# Altium schematic sheet Modulator.SchDoc
size A
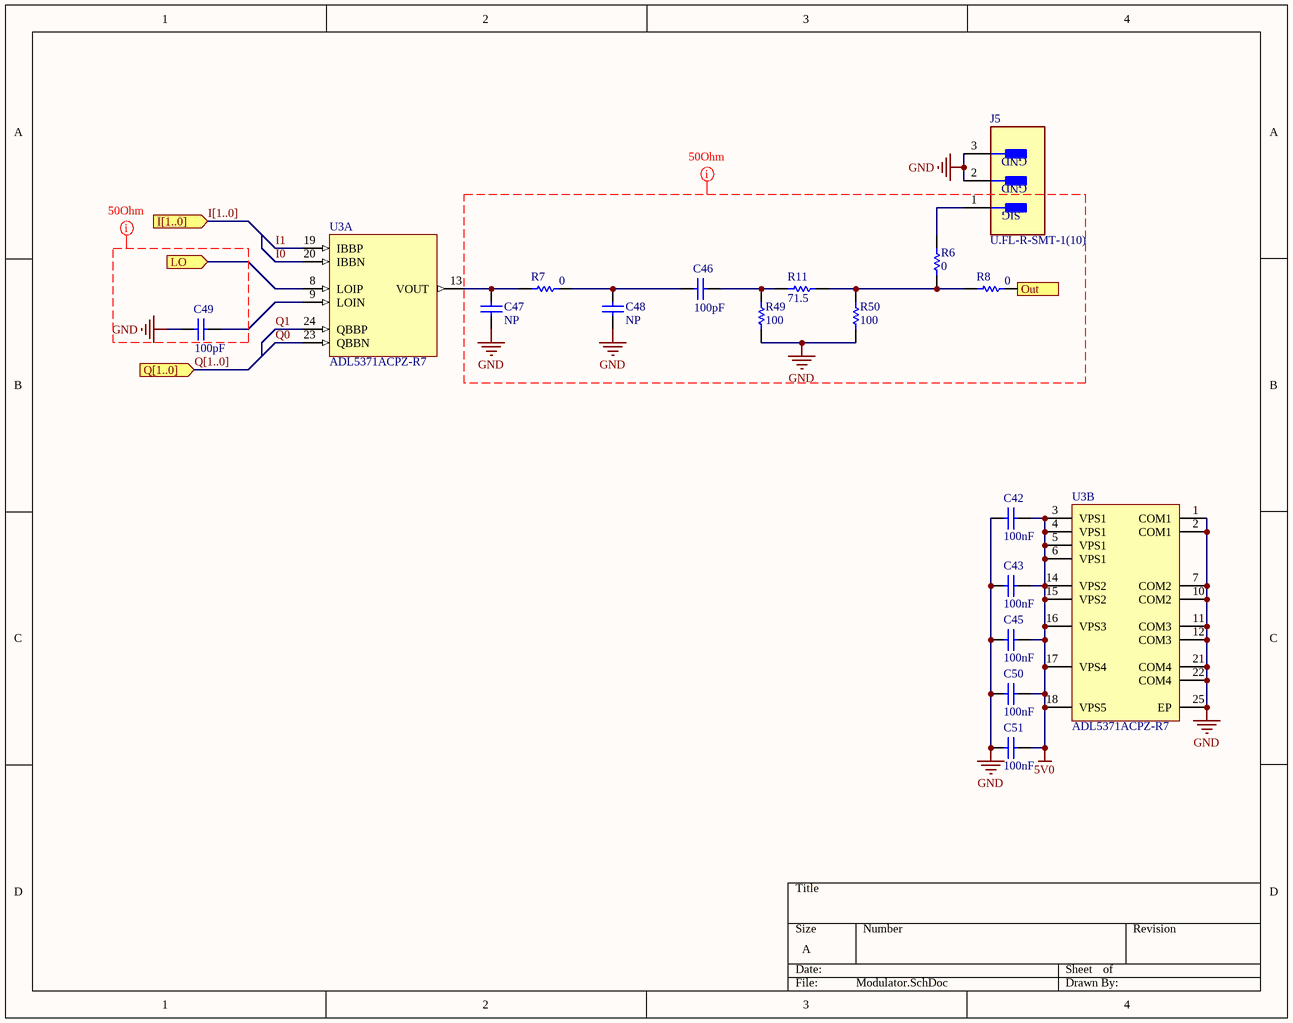
[diagram p0: Modulator.SchDoc]

## Parts
C42  value 100nF  [0402-A]  (hidden comment: Cap)
C43  value 100nF  [0402-A]  (hidden comment: Cap)
C45  value 100nF  [0402-A]  (hidden comment: Cap)
C46  value 100pF  [0402-A]  (hidden comment: Cap)
C47  value NP  [0402-A]  (hidden comment: Cap)
C48  value NP  [0402-A]  (hidden comment: Cap)
C49  value 100pF  [0402-A]  (hidden comment: Cap)
C50  value 100nF  [0402-A]  (hidden comment: Cap)
C51  value 100nF  [0402-A]  (hidden comment: Cap)
J5  U.FL-R-SMT-1(10)  [FP-U_FL-R-SMT-1_10-MFG]
R6  value 0  [0402-A]  (hidden comment: Res1)
R7  value 0  [0402-A]  (hidden comment: Res1)
R8  value 0  [0402-A]  (hidden comment: Res1)
R11  value 71.5  [0402-A]  (hidden comment: Res1)
R49  value 100  [0402-A]  (hidden comment: Res1)
R50  value 100  [0402-A]  (hidden comment: Res1)
U3  ADL5371ACPZ-R7  [ADI-CP-24-2_N]  (parts A,B of 2)

## Ports
I[1..0] (in), LO (in), Out (out), Q[1..0] (in)

## Nets
5V0: C42.2 C43.2 C45.2 C50.2 C51.2 U3.3(VPS1) U3.4(VPS1) U3.5(VPS1) U3.6(VPS1) U3.14(VPS2) U3.15(VPS2) U3.16(VPS3) U3.17(VPS4) U3.18(VPS5)
GND: C42.1 C43.1 C45.1 C47.2 C48.2 C49.2 C50.1 C51.1 J5.2(GND) J5.3(GND) R49.2 R50.2 U3.1(COM1) U3.2(COM1) U3.7(COM2) U3.10(COM2) U3.11(COM3) U3.12(COM3) U3.21(COM4) U3.22(COM4) U3.25(EP)
I0: U3.20(IBBN)
I1: U3.19(IBBP)
LO: U3.8(LOIP) ; port LO
Out: R8.1 ; port Out
Q0: U3.23(QBBN)
Q1: U3.24(QBBP)
NetC46_1: C46.1 R11.1 R49.1
NetC46_2: C46.2 C48.1 R7.1
NetC47_1: C47.1 R7.2 U3.13(VOUT)
NetC49_1: C49.1 U3.9(LOIN)
NetJ5_1: J5.1(SIG) R6.1
NetR6_2: R6.2 R8.2 R11.2 R50.1

## Buses and harness runs
bus I[1..0] = port I[1..0]
bus Q[1..0] = port Q[1..0]

## Layout directives
net class 50Ohm: GND

## Library data of the parts
C42 C43 C45-C51 = Cap: Capacitor; Published: 8-Jun-2000; LatestRevisionDate: 17-Jul-2002; LatestRevisionNote: Re-released for DXP Platform.; PackageReference: RAD-0.3; Publisher: Altium Limited; PackageDescription: Radial Cap, Thru-Hole; 2 Leads; 0.3 in Pin Spacing
J5 = CMP-2000-05152-2: CONN U.FL RCPT STR 50 OHM SMD; Body Plating: Silver; Impedance: 50R; Frequency: 6GHz; Connector Type: Coaxial; Dielectric Material: Polymer; Insulation Resistance: 500MR; Body Material: Bronze; Gender: Male; REACH SVHC: No SVHC; Depth: 3.1mm; Housing Color: Beige; Contact Material: Brass; Package Quantity: 2500; Max Frequency: 6GHz; Radiation Hardening: No; Packaging: Tape and Reel; Termination: Solder; Lead Free: Lead Free; Wire/Cable Type: Coaxial; Min Operating Temperature: -40°C; Max Operating Temperature: 90°C; Contact Plating: Gold; Mount: Surface Mount; Fastening Type: Snap; Orientation: Straight; Length: 3mm
R6-R8 R11 R49 R50 = Res1: Resistor; Published: 8-Jun-2000; LatestRevisionDate: 17-Jul-2002; LatestRevisionNote: Re-released for DXP Platform.; PackageReference: AXIAL-0.3; Publisher: Altium Limited; PackageDescription: Axial Device, Thru-Hole; 2 Leads; 0.3 in Pin Spacing
U3 = CMP-0285-00063-1: 500 MHz to 1500 MHz Quadrature Modulator, CP-24-2, Pb-Free, 1500 Reel; IIP3 (+dBm): 27dBm; Min RF Frequency (MHz): 700MHz; Output P1dB (dBm): 14.4; IQ Freq (MHz): 500MHz; Max RF Frequency (MHz): 1.3GHz; ComponentLink1URL: www.analog.com; PackageReference: CP-24-2; ComponentLink3Description: Package Specification; DatasheetVersion: Rev0; PackageVersion: Jan-2005; ComponentLink3URL: http://www.analog.com/static/imported-files/packages/588305704543880784658541CP_24_2.pdf; Code_JEDEC: MO-220-VGGD-2; ComponentLink1Description: Manufacturer URL; PackageDescription: 24-Lead Lead Frame Chip Scale Package [LFCSP_VQ]; ComponentLink2URL: http://www.analog.com/static/imported-files/data_sheets/ADL5371.pdf; ComponentLink2Description: Datasheet